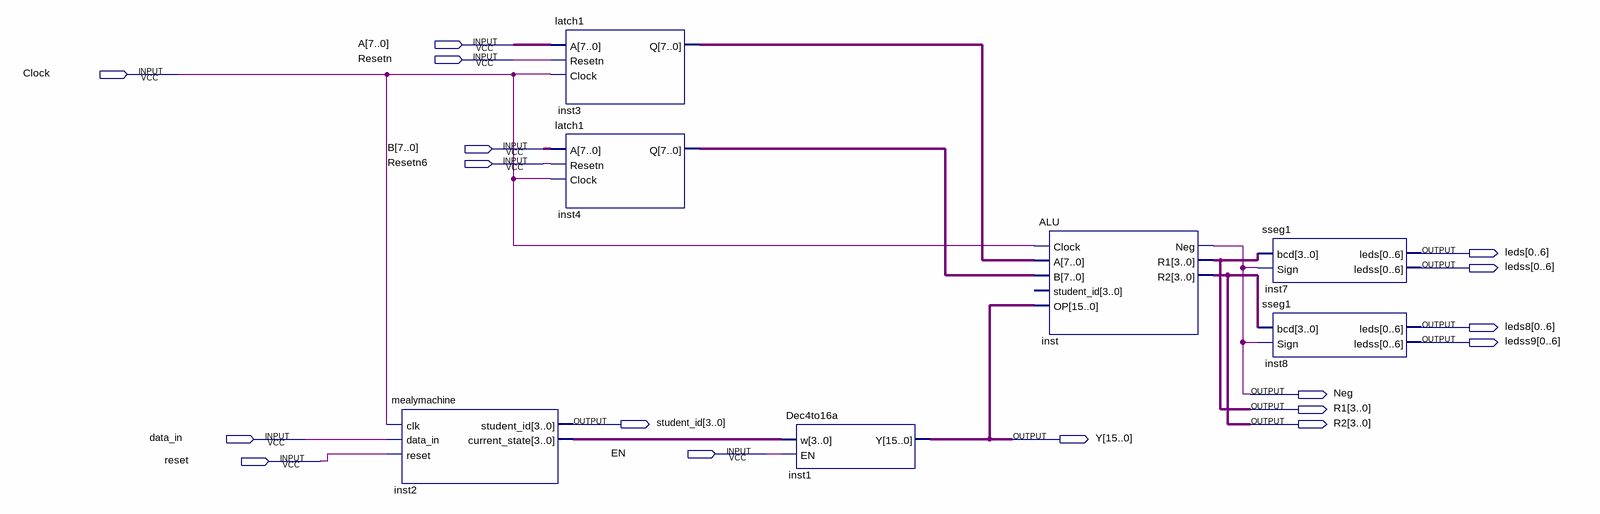
[diagram p0: schematic sheet]
// Quartus schematic ALUBlock.bdf as structural Verilog: 7 symbols, 17 pins
module ALUBlock (
  input  [7:0] A,
  input  Resetn,
  input  Clock,
  input  [7:0] B,
  input  Resetn6,
  input  data_in,
  input  EN,
  input  reset,
  output [0:6] leds,
  output [0:6] ledss,
  output [0:6] leds8,
  output [0:6] ledss9,
  output Neg,
  output [3:0] R1,
  output [3:0] student_id,
  output [3:0] R2,
  output [15:0] Y
);

  wire [3:0] inst2_current_state;
  wire [7:0] inst3_q, inst4_q;

  mealymachine inst2 (
    .clk(Clock), .data_in(data_in), .reset(reset), .student_id(student_id),
    .current_state(inst2_current_state));
  latch1 inst3 (.A(A), .Resetn(Resetn), .Clock(Clock), .Q(inst3_q));
  latch1 inst4 (.A(B), .Resetn(Resetn6), .Clock(Clock), .Q(inst4_q));
  Dec4to16a inst1 (.w(inst2_current_state), .EN(EN), .Y(Y));
  ALU inst (.Clock(Clock), .A(inst3_q), .B(inst4_q), .OP(Y), .Neg(Neg), .R1(R1), .R2(R2));  // open: student_id
  sseg1 inst7 (.bcd(R1), .Sign(Neg), .leds(leds), .ledss(ledss));
  sseg1 inst8 (.bcd(R2), .Sign(Neg), .leds(leds8), .ledss(ledss9));
endmodule
